# Altium schematic sheet Temperature sensor iron.SchDoc
size A4; SheetNumber: 5; SheetTotal: 8
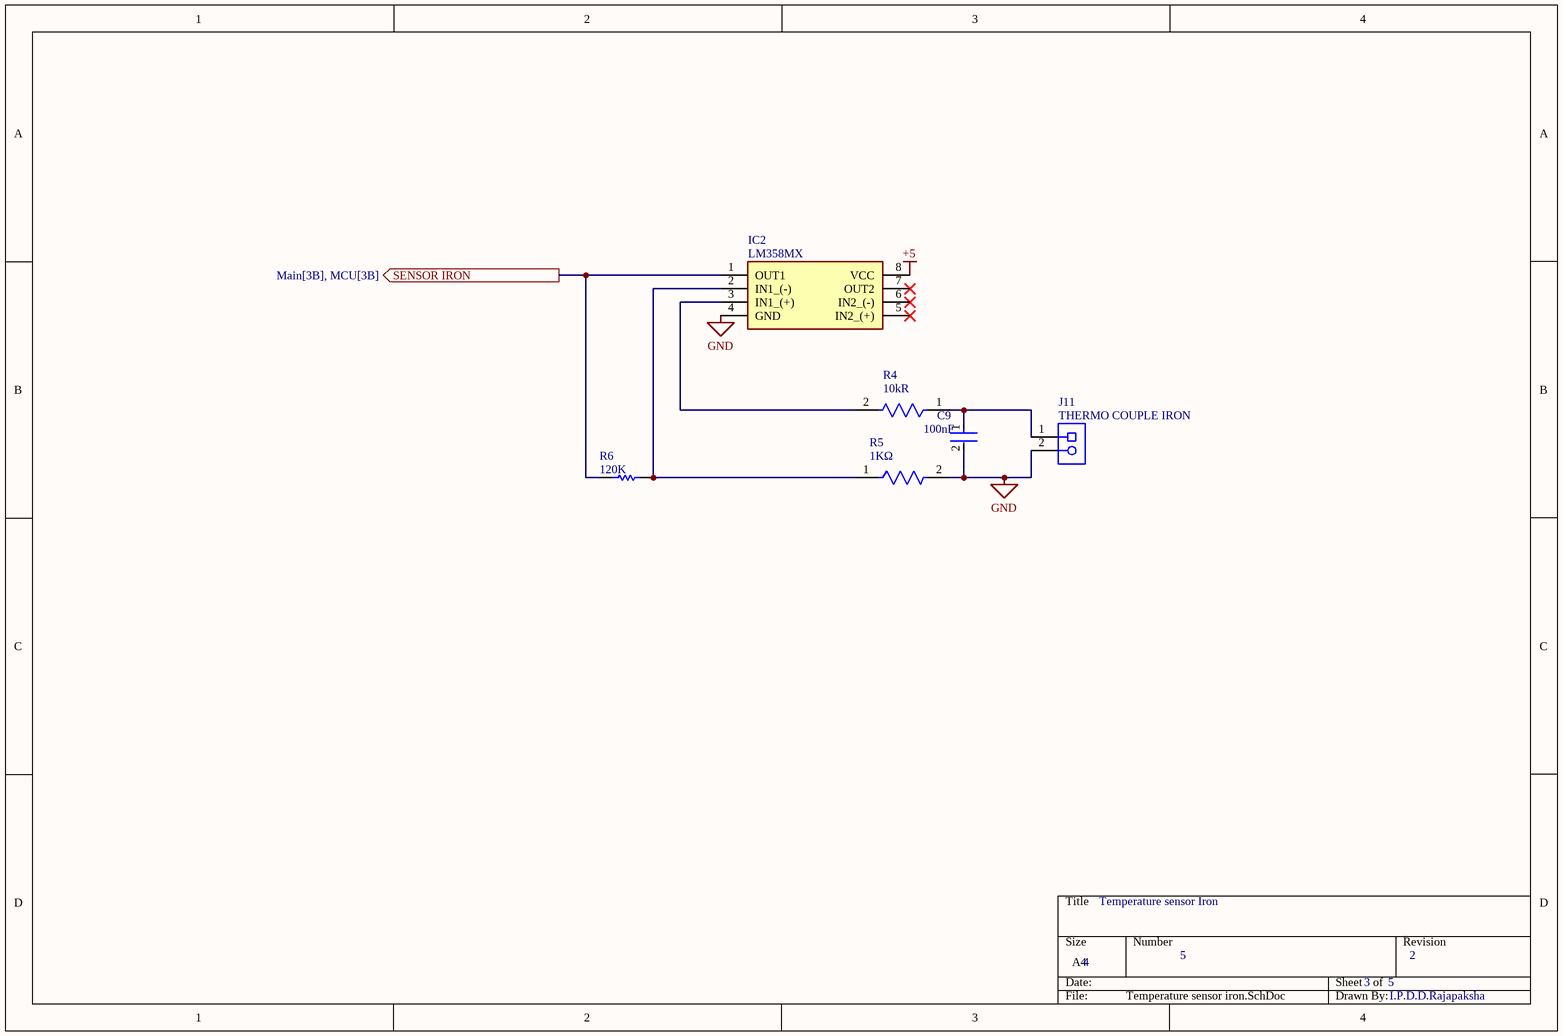
[diagram p0: Temperature sensor iron.SchDoc]

## Parts
C9  Capacitance: 100nF  [FP-0805-L_2_01_0_2-W_1_25-IPC_A]  (hidden comment: 0805YC104M4T2A)
IC2  LM358MX  [SOIC127P600X175-8N]
J11  Parameter 1: THERMO COUPLE IRON  [PHOE-1729128-2_V]  (hidden comment: 1729128)
R4  Resistance: 10kR  [FP-CRCW1206-e3-IPC_C]  (hidden comment: CRCW120610K0FKEA)
R5  value 1KΩ  [FP-CRGCQ1206-IPC_C]  (hidden comment: CRGCQ1206F1K0)
R6  Parameter 1: 120K  [RESC3216X60X45LL10T20]  (hidden comment: CRCW1206120KFKEA)

## Ports
SENSOR IRON (out, see Main[3B], MCU[3B])

## Nets
+5: IC2.8(VCC)
GND: C9.2 IC2.4(GND) J11.2 R5.2
SENSOR IRON: IC2.1(OUT1) R6.2 ; port SENSOR IRON
NetC9_1: C9.1 J11.1 R4.1
NetIC2_2: IC2.2(IN1_(-)) R5.1 R6.1
NetIC2_3: IC2.3(IN1_(+)) R4.2

Not connected (* = marked no-connect by the designer): IC2 5(IN2_(+))* 6(IN2_(-))* 7(OUT2)*

## Notes on the sheet
- Temperature sensor Iron
- 4
- 5
- 3      5
- 2
- I.P.D.D.Rajapaksha

## Library data of the parts
C9 = CMP-04427-015812-1: Automotive Ceramic Capacitor, 0805, 100nF, 20%, X7R, 0.15, 16V; Termination: SMD/SMT; Case Code (Metric): 2012; Length: 0.079inch; Dielectric: X7R; Max Operating Temperature: 125°C; Thickness: 0.037inch; Ratings: AEC-Q200; Package Quantity: 4000; Weight: 0.000194oz; Voltage Rating: 16V; Voltage Rating (DC): 16V; Mount: Surface Mount; Width: 1.25mm; Packaging: Tape and Reel; Tolerance: 20%; Case/Package: 0805; Height: 0.94mm; Case Code (Imperial): 0805; Min Operating Temperature: -55°C
IC2 = LM358MX: Integrated Circuit; Manufacturer_Name: onsemi; Datasheet Link: http://www.onsemi.com/pub/Collateral/LM358A-D.pdf; Height: 1.75mm; Manufacturer_Part_Number: LM358MX; Mouser Part Number: 512-LM358MX; Mouser Price/Stock: https://www.mouser.co.uk/ProductDetail/onsemi-Fairchild/LM358MX?qs=k6rL%2Fc%252BPp3K5YsPvcEtWGQ%3D%3D; Arrow Part Number: LM358MX; Arrow Price/Stock: https://www.arrow.com/en/products/lm358mx/on-semiconductor
J11 = CMP-2000-05815-1: PCB Terminal Block, 13.5 A, 400 V, 2-Pin THD, RoHS, Bulk; Manufacturer: Phoenix Contact; Package Version: 03/2015; No. of Rows: 1; Pitch: 5.08mm; No. of Positions: 2; Voltage Rating: 400V; Current Rating: 13500mA; Manufacturer URL: http://www.phoenixcontact.com/; Datasheet URL: https://datasheet.ciiva.com/16046/1729128-16046181.pdf; RoHS: TRUE; Package URL: https://www.phoenixcontact.com/online/portal/pi/pxc/product_detail_page/!ut/p/b1/3VdJjqNKFDxLH8AFycySyWY2ozFsEPOMMQaDOX1XedGL_1Vdm5YXJleknhSKeBkvI6EA8ncAo3AYoDhBQGco6KN7VURTdemj9us_IEKEZo_YHiPAEWEFmDGOHMORkqKYCORBZxgL7ZoaZYcbFFUZ3fqxSY6GOuxydWUuHqz1ynmMFygu583Bob0Ewr6Sd_l-5m-kAueHiB0jpRwZwe58wwtkpxtMYd_LmGcDRU02dRNEyWt6Y2ti5pSyJ_reIkzIulrqApdnbT11V5jnCKbYNCvhEM1MCpPByat_X379-iThf08CI5GfOPqfBeS3BRoBOdD55AKVv0iLwCMq-2BrzXWSGRH7pUGD9uwXQjiph3xL0DKQwdGa0JImiIOmBNOestqgwTHSSs2oOep-78apyXQBvNi8ZLaFjvjWvcaUEBu0MC6Wbe-d6mB0FAebo2lUWinqYaZs5DAYzV0RP9yitUjnGJ0iI9xhZkT42OCQNUJJhkgWINNQLP2JFP6OpMg3JCVg70jqHT0lvKOnhHf0lPuOnnLf0VPuWx6_dxwUIvwk5WMkT0kLL1mh61l2yZVSzG3pYV_bqo-mj6uMKwKwdnnW8Jh5RTOJzMOA5c-eJDaZQw4mTMPH02PvS_ZAqNVjVTo2WyYLkwH_KU1mmmG5kjRhDqPXLwwVHvVOjCM60-fpXvTDfMGW1PVFVS1r4e4yVDk4ZdNbkUHvqPqQSeian4UD39fNKmachqdJ1NJbyk8rXT9mXTvPk3oE5meulKGgiruPJek-4I9hTT6G8ZLOyRSm2RRVbThERQad5OS28hdt4YW4vG0stgYYzsWsK4_7y6DZMjJSCqri1kyiZR5vD7pwIrNR7QwPHTcLTI5qT7eRlpHrdGiupYlqQDJ7zy_CND8fWWBoLRXxk1RVcXiBQwbTD4Xi7KL-FuO94t9xaqweXzH; PartNumber: 1729128; Package Description: 2-Pin Through Hole Device, Body 8.1 x 10.16 mm, Pitch 5.08 mm; Datasheet Version: 12/2013; Mounting Technology: ThroughHole; Orientation: Horizontal; Package Reference: 1729128-2; Packing: Bulk
R4 = CMP-2003-04807-2: RES Thick Film, 10kΩ, 1%, 0.25W, 100ppm/°C, 1206; Working Voltage: 200V; Max Power Dissipation: 250mW; Tolerance: 1%; Width: 0.063inch; Height: 0.55mm; Number of Pins: 2; Voltage Rating: 200V; Temperature Coefficient: 100ppm/°C; Military Standard: Not; Features: Automotive AEC-Q200; Depth: 1.6mm; Radiation Hardening: No; Termination: SMD/SMT; Case Code (Imperial): 1206; Weight: 0.000353oz; Length: 3.2mm; Package Quantity: 10; Voltage Rating (DC): 200V; Case/Package: 1206; Min Operating Temperature: -55°C; Number of Terminations: 2; Composition: Thick Film; Contact Plating: Tin; Power Rating: 250mW; Packaging: Tape and Reel; Max Operating Temperature: 155°C; Lead Free: Lead Free; Case Code (Metric): 3216
R5 = CMP-03211-006592-1: CRGCQ1206 1KΩ 0.25W 1% ±100ppm/°C 200V; Manufacturer: TE Connectivity; Automotive Grade: Grade 685; Tolerance: 0.01; Ipc Land Pattern Name: RESC310155X55; Temperature Range Low: -55°C; Device Class L3: Chip SMD Resistors; ComponentLink2URL: https://www.te.com/commerce/DocumentDelivery/DDEController?Action=showdoc&DocId=Data+Sheet%7F1773204-3%7F1%7Fpdf%7FEnglish%7FENG_DS_1773204-3_1.pdf%7F4-2176347-694; Automotive: Yes; Temperature: -55°C to +155°C; Manufacturer Part Number: CRGCQ1206F1K0; Package: CRGCQ1206; Octopart: https://octopart.com/crgcq1206f1k0-te+connectivity-91018258; Device Class L1: Passive Components; Series: CRGCQ; Device Class L2: Resistors; RoHS: TRUE; Lead Free: Yes; ComponentLink2Description: Datasheet; Power Rating: 0.25W; Temperature Coefficient: ±100ppm/°C; Voltage Rating: 200V; Temperature Range High: +155°C; Height: 0.65mm; Category: Res; Resistance: 1KΩ; Composition: Thick Film; Ambient Temperature Range High: +70°C
R6 = CMP-2003-04836-1: Manufacturer: Vishay Dale; Part Number: CRCW1206120KFKEA